# EAGLE schematic US (EAGLE 8.5.1)
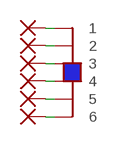
[diagram p0: schematic, sheet 1]

## Parts
C1  6P6C_FEMALESMD  [6P6C_FEMALE]
PAD1  2,54/1,0  [2,54/1,0]
PAD2  2,54/1,0  [2,54/1,0]
PAD3  2,54/1,0  [2,54/1,0]
PAD4  2,54/1,0  [2,54/1,0]
PAD5  2,54/1,0  [2,54/1,0]
PAD6  2,54/1,0  [2,54/1,0]

## Nets
N$1: C1.1 PAD1.1(P)
N$2: C1.2 PAD2.1(P)
N$3: C1.3 PAD3.1(P)
N$4: C1.4 PAD4.1(P)
N$5: C1.5 PAD5.1(P)
N$6: C1.6 PAD6.1(P)

## Library data of the parts
C1 = Yijiano:6P6C_FEMALE
PAD1-PAD6 = wirepad:2,54/1,0: THROUGH-HOLE PAD